# EAGLE design queso_dip_v5 (EAGLE 6.5.0)
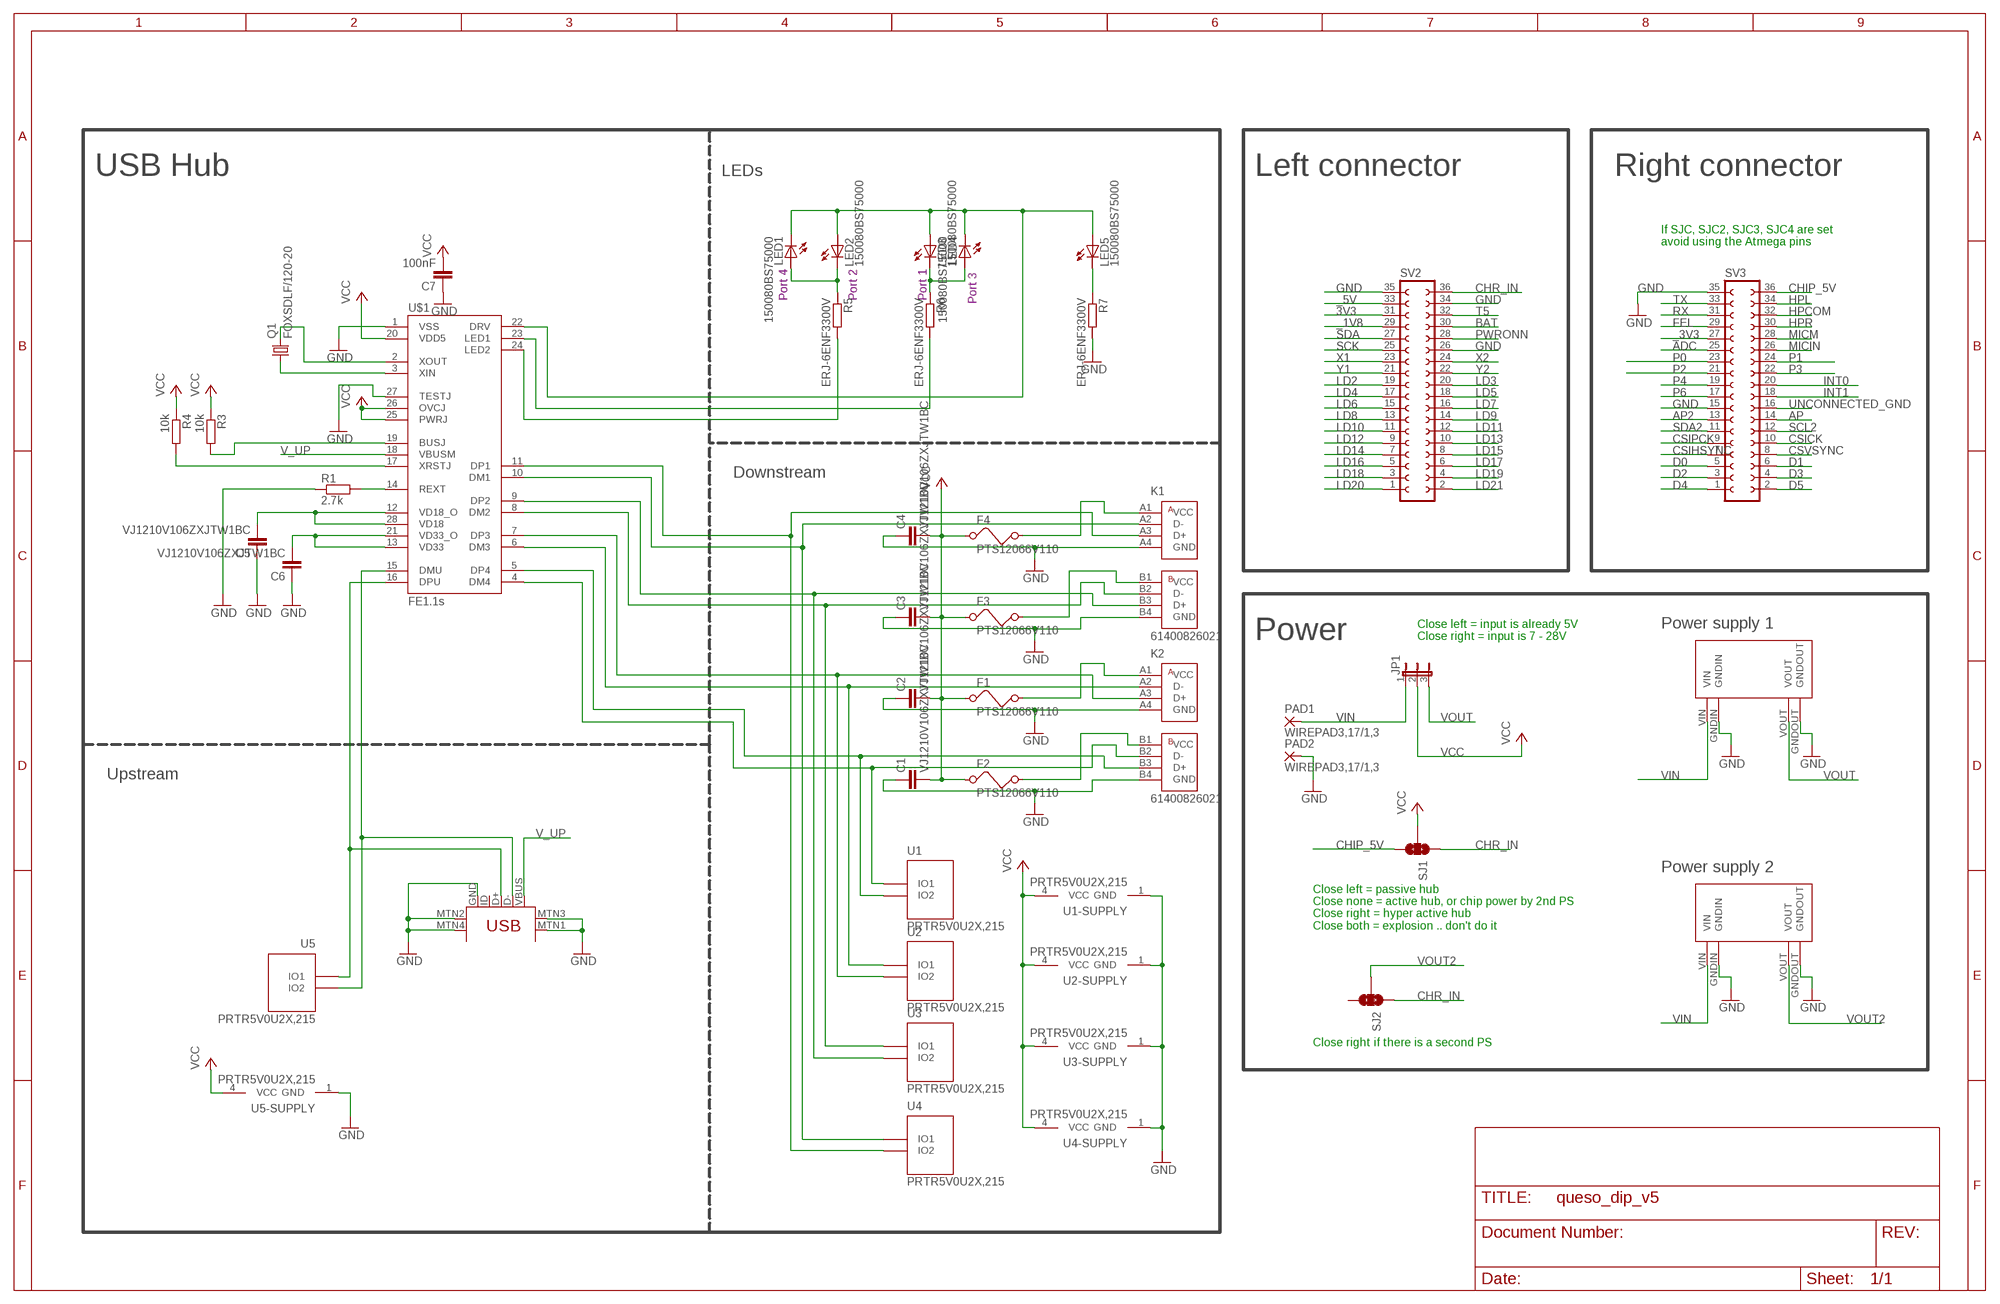
[diagram p0: schematic, sheet 1]

## Parts
C1  VJ1210V106ZXJTW1BC  C-EUC1210  [C1210]
C2  VJ1210V106ZXJTW1BC  C-EUC1210  [C1210]
C3  VJ1210V106ZXJTW1BC  C-EUC1210  [C1210]
C4  VJ1210V106ZXJTW1BC  C-EUC1210  [C1210]
C5  VJ1210V106ZXJTW1BC  C-EUC1210  [C1210]
C6  VJ1210V106ZXJTW1BC  C-EUC1210  [C1210]
C7  100nF  C-EUC0805  [C0805]
F1  PTS12066V110  FUSED  [1210]
F2  PTS12066V110  FUSED  [1210]
F3  PTS12066V110  FUSED  [1210]
F4  PTS12066V110  FUSED  [1210]
JP1  JP2E  [JP2]
K1  61400826021  [61400826021]
K2  61400826021  [61400826021]
LED1  150080BS75000  LEDCHIP-LED0805  [CHIP-LED0805]
LED2  150080BS75000  LEDCHIP-LED0805  [CHIP-LED0805]
LED3  150080BS75000  LEDCHIP-LED0805  [CHIP-LED0805]
LED4  150080BS75000  LEDCHIP-LED0805  [CHIP-LED0805]
LED5  150080BS75000  LEDCHIP-LED0805  [CHIP-LED0805]
PAD1  WIREPAD3,17/1,3  [3,17/1,3]
PAD2  WIREPAD3,17/1,3  [3,17/1,3]
Q1  FOXSDLF/120-20  CRYSTALSM49  [SM49]
R1  2.7k  R-EU_R0805  [R0805]
R3  10k  R-EU_R0805  [R0805]
R4  10k  R-EU_R0805  [R0805]
R5  ERJ-6ENF3300V  R-EU_R0805  [R0805]
R6  ERJ-6ENF3300V  R-EU_R0805  [R0805]
R7  ERJ-6ENF3300V  R-EU_R0805  [R0805]
SJ1  SOLDERJUMPER_2WAYT  [SJ_2]
SJ2  SOLDERJUMPER_2WAYT  [SJ_2]
SV2  FE18-2  [FE18-2]
SV3  FE18-2  [FE18-2]
U1  PRTR5V0U2X,215  PRTR5V0U2X  [SOT-143B]
U2  PRTR5V0U2X,215  PRTR5V0U2X  [SOT-143B]
U3  PRTR5V0U2X,215  PRTR5V0U2X  [SOT-143B]
U4  PRTR5V0U2X,215  PRTR5V0U2X  [SOT-143B]
U5  PRTR5V0U2X,215  PRTR5V0U2X  [SOT-143B]
U$1  FE1.1S  [FE1.1S_SSOP-28]
U$3  MP1584EN  [MP1584EN]
U$8  10118194-0001LF  USB-MINIB-5PIN  [USB-MINIB]
U$9  MP1584EN  [MP1584EN]

## Nets
3V3: SV2.31
_1V8: SV2.29
_3V3: SV3.27
_5V: SV2.33
ADC: SV3.25
AP: SV3.14
AP2: SV3.13
BAT: SV2.30
CHIP_5V: SJ1.3 SV3.36
CHR_IN: SJ1.1 SJ2.1 SV2.36
CSICK: SV3.10
CSIHSYNC: SV3.7
CSIPCK: SV3.9
CSVSYNC: SV3.8
D0: SV3.5
D1: SV3.6
D2: SV3.3
D3: SV3.4
D4: SV3.1
D5: SV3.2
DM1: K1.A2(D-) U4.2(IO1) U$1.10(DM1)
DM2: K1.B2(D-) U3.2(IO1) U$1.8(DM2)
DM3: K2.A2(D-) U2.2(IO1) U$1.6(DM3)
DM4: K2.B2(D-) U1.2(IO1) U$1.4(DM4)
DMU: U5.3(IO2) U$1.15(DMU) U$8.D-
DP1: K1.A3(D+) U4.3(IO2) U$1.11(DP1)
DP2: K1.B3(D+) U3.3(IO2) U$1.9(DP2)
DP3: K2.A3(D+) U2.3(IO2) U$1.7(DP3)
DP4: K2.B3(D+) U1.3(IO2) U$1.5(DP4)
DPU: U5.2(IO1) U$1.16(DPU) U$8.D+
FEL: SV3.29
GND: C1.1 C2.1 C3.1 C4.1 C5.1 C6.1 C7.1 K1.A4(GND) K1.B4(GND) K2.A4(GND) K2.B4(GND) PAD2.1(P) R1.1 R7.2 SV2.26 SV2.34 SV2.35 SV3.15 SV3.35 U1.1(GND) U2.1(GND) U3.1(GND) U4.1(GND) U5.1(GND) U$1.1(VSS) U$1.27(TESTJ) U$3.GNDIN U$3.GNDOUT U$8.GND U$8.MTN1(MTN2) U$8.MTN2(MTN3) U$8.MTN3(MTN1) U$8.MTN4 U$9.GNDIN U$9.GNDOUT
HPCOM: SV3.32
HPL: SV3.34
HPR: SV3.30
INT0: SV3.20
INT1: SV3.18
LD2: SV2.19
LD3: SV2.20
LD4: SV2.17
LD5: SV2.18
LD6: SV2.15
LD7: SV2.16
LD8: SV2.13
LD9: SV2.14
LD10: SV2.11
LD11: SV2.12
LD12: SV2.9
LD13: SV2.10
LD14: SV2.7
LD15: SV2.8
LD16: SV2.5
LD17: SV2.6
LD18: SV2.3
LD19: SV2.4
LD20: SV2.1
LD21: SV2.2
MICIN: SV3.26
MICM: SV3.28
N$1: F2.2 K2.B1(VCC)
N$10: F1.2 K2.A1(VCC)
N$11: F3.2 K1.B1(VCC)
N$12: F4.2 K1.A1(VCC)
N$14: R5.2 U$1.24(LED2)
N$15: R6.2 U$1.23(LED1)
N$17: C6.2 U$1.13(VD33) U$1.21(VD33_O)
N$18: C5.2 U$1.12(VD18_O) U$1.28(VD18)
N$22: R1.2 U$1.14(REXT)
N$24: R4.2 U$1.17(XRSTJ)
N$25: R3.2 U$1.19(BUSJ)
N$27: Q1.2 U$1.2(XOUT)
N$28: Q1.1 U$1.3(XIN)
N$29: LED5.C R7.1
N$30: LED3.C LED4.A R6.1
N$31: LED1.A LED2.C R5.1
N$32: LED1.C LED2.A LED3.A LED4.C LED5.A U$1.22(DRV)
P0: SV3.23
P1: SV3.24
P2: SV3.21
P3: SV3.22
P4: SV3.19
P6: SV3.17
PWRONN: SV2.28
RX: SV3.31
SCK: SV2.25
SCL2: SV3.12
SDA: SV2.27
SDA2: SV3.11
T5: SV2.32
TX: SV3.33
UNCONNECTED_GND: SV3.16
V_UP: U$1.18(VBUSM) U$8.VBUS
VCC: C1.2 C2.2 C3.2 C4.2 C7.2 F1.1 F2.1 F3.1 F4.1 JP1.2 R3.1 R4.1 SJ1.2 U1.4(VCC) U2.4(VCC) U3.4(VCC) U4.4(VCC) U5.4(VCC) U$1.20(VDD5) U$1.25(PWRJ) U$1.26(OVCJ)
VIN: JP1.1 PAD1.1(P) U$3.VIN U$9.VIN
VOUT: JP1.3 U$9.VOUT
VOUT2: SJ2.2 U$3.VOUT
X1: SV2.23
X2: SV2.24
Y1: SV2.21
Y2: SV2.22
Unconnected: SJ2.3 U$8.ID

## Notes on the sheet
- USB Hub | LEDs | Left connector | Right connector
- If SJC, SJC2, SJC3, SJC4 are set 
  avoid using the Atmega pins
- Port 4 | Port 2 | Port 1
- Port 3
- Downstream
- Power supply 1
- Power
- Close left = input is already 5V
  Close right = input is 7 - 28V
- Upstream
- Power supply 2
- Close left = passive hub
  Close none = active hub, or chip power by 2nd PS
  Close right = hyper active hub
  Close both = explosion .. don't do it
- Close right if there is a second PS

## Library data of the parts
C1-C7 = rcl:C-EU: CAPACITOR, European symbol
F1-F4 = m-pad-2.1:FUSE: Fuse's in various packages
JP1 = jumper:JP2E: JUMPER
K1 K2 = Wuerth_Elektronik_eiCan_Communication_Connectors_STENCIL:61400826021: WR-COM Horizontal Dual Stacked USB Type A
LED1-LED5 = led:LED: LED OSRAM: - CHIPLED LG R971, LG N971, LY N971, LG Q971, LY Q971, LO R971, LY R971 LH N974, LH R974 LS Q976, LO Q976, LY Q976 LO Q996 - Hyper CHIPLED LW Q18S LB Q993, LB Q99A, LB R99A - SideLED LS A670, LO A670, LY A670, LG A670, LP A670 LB A673, LV A673, LT A673, LW A673 LH A674 LY A675 LS A676, LA A676, LO A676, LY A676, LW A676 LS A679, LY A679, LG A679 - Hyper Micro SIDELED® LS Y876, LA Y876, LO Y876, LY Y876 LT Y87S - SmartLED LW L88C, LW L88S LB L89C, LB L89S, LG L890 LS L89K, LO L89K, LY L89K LS L896, LA L896, LO L896, LY L896 - TOPLED LS T670, LO T670, LY T670, LG T670, LP T670 LSG T670, LSP T670, LSY T670, LOP T670, LYG T670 LG T671, LOG T671, LSG T671 LB T673, LV T673, LT T673, LW T673 LH T674 LS T676, LA T676, LO T676, LY T676, LB T676, LH T676, LSB T676, LW T676 LB T67C, LV T67C, LT T67C, LS T67K, LO T67K, LY T67K, LW E67C LS E67B, LA E67B, LO E67B, LY E67B, LB E67C, LV E67C, LT E67C LW T67C LS T679, LY T679, LG T679 LS T770, LO T770, LY T770, LG T770, LP T770 LB T773, LV T773, LT T773, LW T773 LH T774 LS E675, LA E675, LY E675, LS T675 LS T776, LA T776, LO T776, LY T776, LB T776 LHGB T686 LT T68C, LB T68C - Hyper Mini TOPLED® LB M676 - Mini TOPLED Santana® LG M470 LS M47K, LO M47K, LY M47K Source: http://www.osram.convergy.de LUXEON: - LUMILED® LXK2-PW12-R00, LXK2-PW12-S00, LXK2-PW14-U00, LXK2-PW14-V00 LXK2-PM12-R00, LXK2-PM12-S00, LXK2-PM14-U00 LXK2-PE12-Q00, LXK2-PE12-R00, LXK2-PE12-S00, LXK2-PE14-T00, LXK2-PE14-U00 LXK2-PB12-K00, LXK2-PB12-L00, LXK2-PB12-M00, LXK2-PB14-N00, LXK2-PB14-P00, LXK2-PB14-Q00 LXK2-PR12-L00, LXK2-PR12-M00, LXK2-PR14-Q00, LXK2-PR14-R00 LXK2-PD12-Q00, LXK2-PD12-R00, LXK2-PD12-S00 LXK2-PH12-R00, LXK2-PH12-S00 LXK2-PL12-P00, LXK2-PL12-Q00, LXK2-PL12-R00 Source: www.luxeon.com KINGBRIGHT: KA-3528ASYC Source: www.kingbright.com
PAD1 PAD2 = wirepad:WIREPAD: Wire PAD connect wire on PCB
Q1 = adafruit:CRYSTAL: CRYSTAL; OC_FARNELL: unknown; OC_NEWARK: unknown
R1 R3-R7 = rcl:R-EU_: RESISTOR, European symbol
SJ1 SJ2 = SparkFun-Retired:SOLDERJUMPER_2WAY: Solder Jumper 2 way solder jumper
SV2 SV3 = con-lsta:FE18-2: FEMALE HEADER; OC_FARNELL: unknown; OC_NEWARK: unknown
U1-U5 = Volks73-NXPSemiconductors:PRTR5V0U2X?: I2C-Bus EDS Protection Ulta low capacitance double rail-to-rail ESD protection diode Documentation Datasheet <http://www.nxp.com/documents/data_sheet/PRTR5V0U2X.pdf> General Description Ultra low capacitance rail-to-rail ElectroStatic Discharge (ESD) protection diode in a small SOT143B Surface-Mounted Device (SMD) plastic package designed to protect two Hi-Speed data lines or high-frequency signal lines from the damage caused by ESD and other transients. PRTR5V0U2X incorporates two pairs of ultra low capacitance rail-to-rail diodes as well as an additional ESD protection diode to ensure signal line protection even if no supply voltage is available. Features ESD protection of two Hi-Speed data lines or high-frequency signal lines Ultra low input/output to ground capacitance: C(I/O-GND) = 1 pF ESD protection up to 8kV IEC 61000-4-2, level 4 (ESD) Very low clamping voltage due to an integrated additional ESD protection diode Very low reverse current Small SMD plastic package Applications USB 2.0 ports Digital Video Interface (DVI)/High Definition Multimedia Interface (HDMI) interfaces Mobile and cordless phones Personal Digital Assistants (PDA) Digital Cameras Wide Area Network (WAN) / Local Area Network (LAN) systems PCs, notebooks, printers, and other PC peripherals; APPLICATIONS: General Purpose; BIDIRECTIONAL_CHANNELS: 2; CAPACITANCE: 1pF @ 1MHz; CURRENT_PEAK_PULSE: -; DESCRIPTION: TVS DIODE 5.5VWM SOT143B; DOCUMENTATION_LINK: <a href="http://www.nxp.com/documents/data_sheet/PRTR5V0U2X.pdf">Datasheet</a>; DOCUMENTATION_URL: http://www.nxp.com/documents/data_sheet/PRTR5V0U2X.pdf; MANUFACTURER: NXP Semiconductors; MOUNTING_TYPE: Surface Mount; OPERATING_TEMPERATURE: -40C ~ 85C; PART_NUMBER: PRTR5V0U2X,215; POWER-PEAK_PULSE: -; POWER_LINE_PROTECTION: Yes; SUPPLIER_ITEM_LINK: <a href="http://www.digikey.com/product-detail/en/PRTR5V0U2X,215/568-4140-1-ND/1589981">Details</a>; SUPPLIER_ITEM_NUMBER: 568-4140-1-ND; SUPPLIER_ITEM_URL: http://www.digikey.com/product-detail/en/PRTR5V0U2X,215/568-4140-1-ND/1589981; SUPPLIER_LINK: <a href="http://www.digikey.com">Home Page</a>; SUPPLIER_NAME: Digi-Key; SUPPLIER_URL: http://www.digikey.com; TYPE: Steering (Rail to Rail); UNIDIRECTIONAL_CHANNELS: -; VOLTAGE_BREAKDOWN: 6V; VOLTAGE_CLAMPING: -; VOLTAGE_REVERSE: 5.5V
U$1 = imcom:FE1.1S: A USB 2.0 hub IC. http://www.jfd-ic.com/Documents/FE1.1s%20Data%20Sheet%20%28Rev.%201.0%29.pdf
U$3 U$9 = power_supply:MP1584EN
U$8 = SparkFun-Connectors:USB-MINIB: Mini-USB "B" connector with 5th pin broken out. Created new symbol breaking out 5th "ID" pin in mini/micro USB connector spec. See: http://en.wikipedia.org/wiki/Mini_usb#Cables. Uses same footprint as 4-pin symbol. Also added pins to connect to mounting / shield pads if required (probably not generally needed as signals aren't shielded once they leave the connector).

## Board
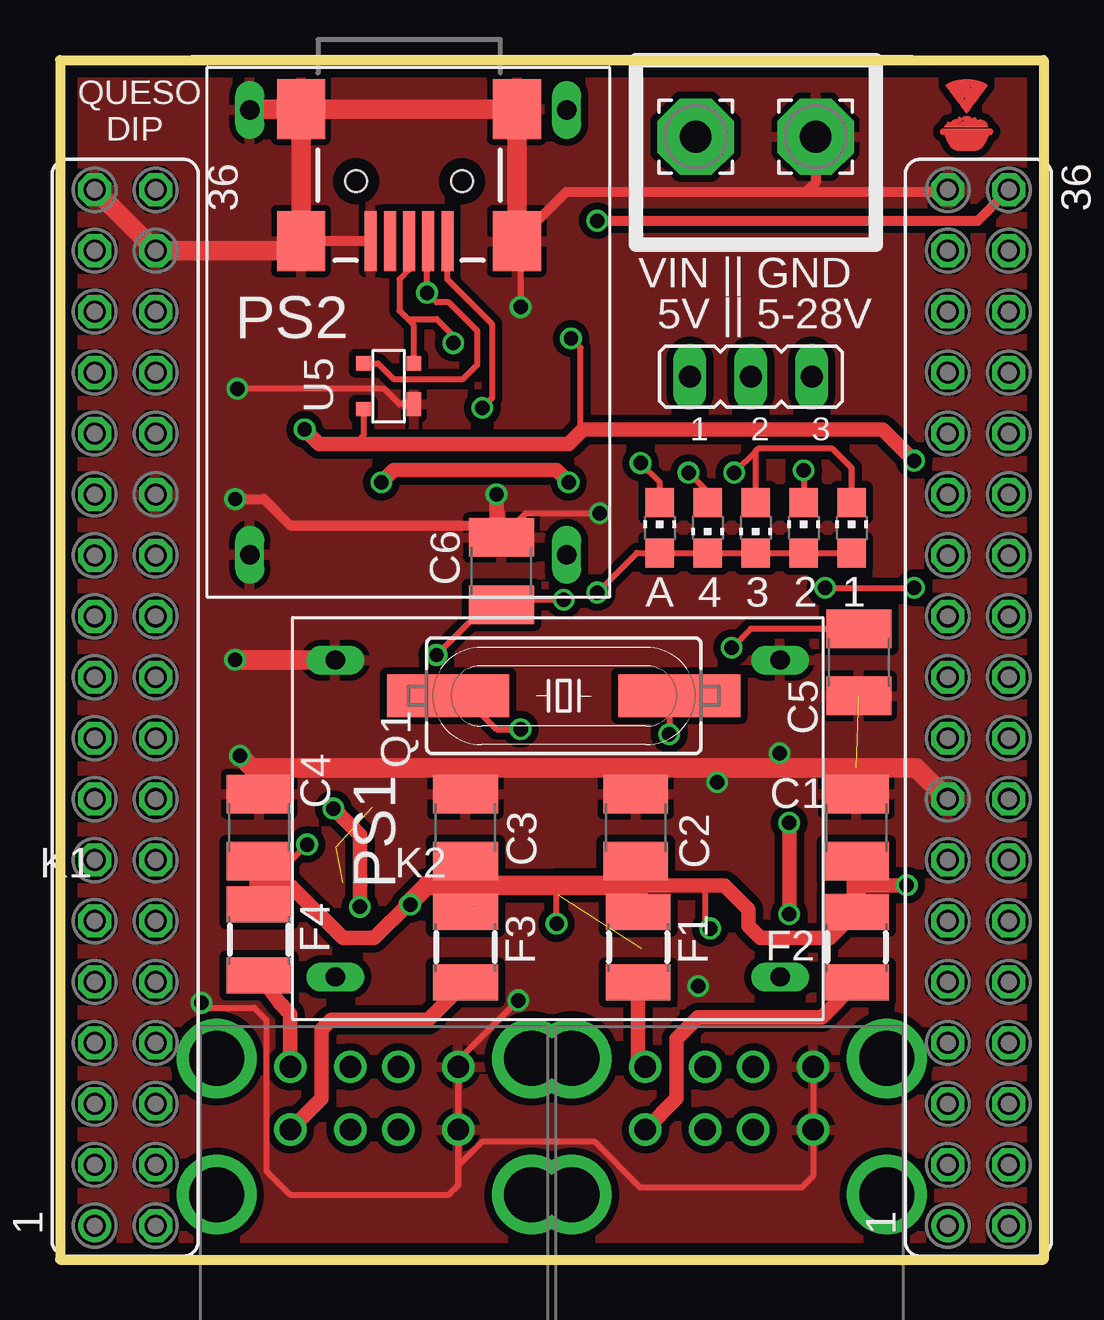
[diagram p1: board, top side]
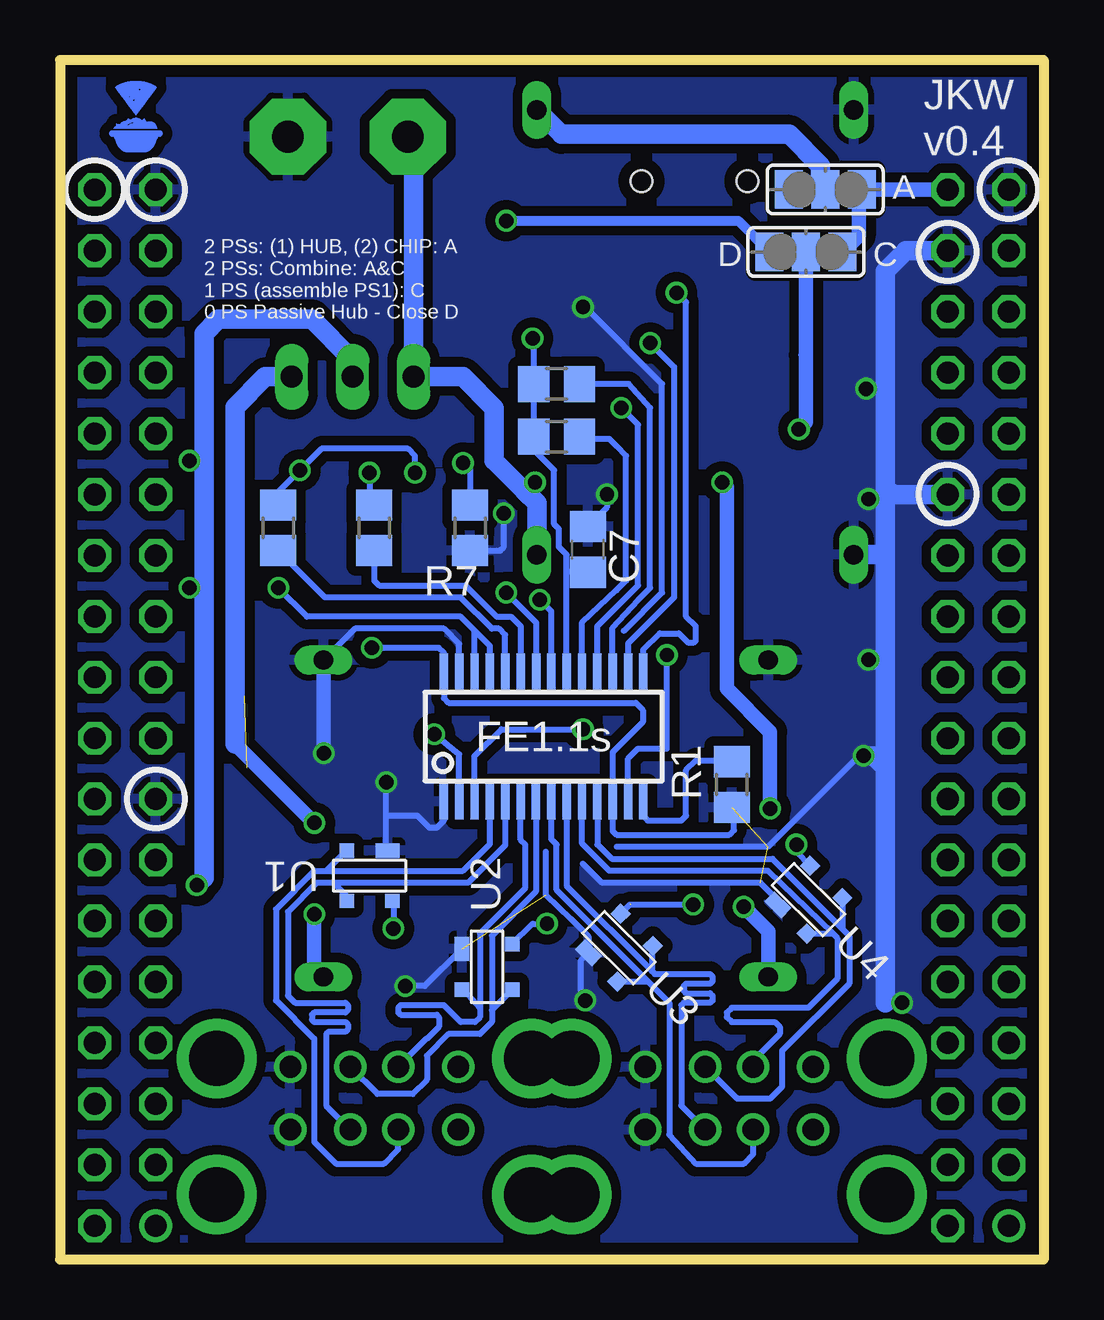
[diagram p2: board, bottom side, seen from below]

Size 41 x 50 mm. Coordinates in mm from the lower left corner, seen from the top.
Outline: 0,50 41,50 41,0 0,0 0,50
Copper layers (1*16): Top 0.035mm / dielectric 1.6mm / Bottom 0.035mm
Design rules "Elecrow_2-layer_PCB_eagle_rule": minimum track width 6mil, minimum drill 12mil, track to track 6mil, track to pad 6mil, pad to pad 6mil, via to via 8mil, smd to smd 0mil, copper to edge 20mil, drill to drill 10mil, minimum pad ring 6mil, minimum via ring 6mil, stop-mask expansion 0mil, vias tented up to drill 100mil, thermal gap 10mil

### Footprints (pad centres in the part's own frame; a part is rotated, then mirrored left to right if it is on the bottom)
C1210 = smd 1.6 x 2.7: 1 -1.4,0; 2 1.4,0
C0805 = smd 1.3 x 1.5: 1 -0.95,0; 2 0.95,0
1210 = smd 1.5 x 2.7: 1 -1.5,0; 2 1.45,0
JP2 = drill 0.914 long: 1 -2.54,0; 2 0,0; 3 2.54,0
61400826021 = drill 2.3: 5 -6.57,5.68; 6 -6.57,0; 7 6.57,0; 8 6.57,5.68 | drill 0.9: A1 -3.5,5.33; A2 -1,5.33; A3 1,5.33; A4 3.5,5.33; B1 -3.5,2.71; B2 -1,2.71; B3 1,2.71; B4 3.5,2.71
CHIP-LED0805 = smd 1.2 x 1.2: A 0,-1.05; C 0,1.05
3,17/1,3 = drill 1.321 pad 3.175 octagon: 1 0,0
SM49 = smd 5.08 x 1.778: 1 -4.826,0; 2 4.826,0
R0805 = smd 1.3 x 1.5: 1 -0.95,0; 2 0.95,0
SJ_2 = smd 1.168 x 1.6: 1 -1.524,0; 2 0,0; 3 1.524,0
FE18-2 = drill 0.914: 1 -21.59,1.27 | drill 0.914 octagon: 2 -21.59,-1.27; 3 -19.05,1.27; 4 -19.05,-1.27; 5 -16.51,1.27; 6 -16.51,-1.27; 7 -13.97,1.27; 8 -13.97,-1.27; 9 -11.43,1.27; 10 -11.43,-1.27; 11 -8.89,1.27; 12 -8.89,-1.27; 13 -6.35,1.27; 14 -6.35,-1.27; 15 -3.81,1.27; 16 -3.81,-1.27; 17 -1.27,1.27; 18 -1.27,-1.27; 19 1.27,1.27; 20 1.27,-1.27; 21 3.81,1.27; 22 3.81,-1.27; 23 6.35,1.27; 24 6.35,-1.27; 25 8.89,1.27; 26 8.89,-1.27; 27 11.43,1.27; 28 11.43,-1.27; 29 13.97,1.27; 30 13.97,-1.27; 31 16.51,1.27; 32 16.51,-1.27; 33 19.05,1.27; 34 19.05,-1.27; 35 21.59,1.27; 36 21.59,-1.27
SOT-143B = smd 1 x 0.6: 1 -0.75,-1.05 | smd 0.6 x 0.6: 2 0.95,-1.05; 3 0.95,1.05; 4 -0.95,1.05
FE1.1S_SSOP-28 = smd 0.35 x 1.5: 1 -4.16,-2.7; 2 -3.52,-2.7; 3 -2.88,-2.7; 4 -2.24,-2.7; 5 -1.6,-2.7; 6 -0.96,-2.7; 7 -0.32,-2.7; 8 0.32,-2.7; 9 0.96,-2.7; 10 1.6,-2.7; 11 2.24,-2.7; 12 2.88,-2.7; 13 3.52,-2.7; 14 4.16,-2.7; 15 4.16,2.7; 16 3.52,2.7; 17 2.88,2.7; 18 2.24,2.7; 19 1.6,2.7; 20 0.96,2.7; 21 0.32,2.7; 22 -0.3,2.7; 23 -0.96,2.7; 24 -1.6,2.7; 25 -2.24,2.7; 26 -2.88,2.7; 27 -3.52,2.7; 28 -4.16,2.7
MP1584EN = drill 0.8 long: GNDIN 1.778,14.986; GNDOUT 20.32,14.986; VIN 1.778,1.778; VOUT 20.32,1.778
USB-MINIB = smd 2.5 x 0.5: D+ 2.5,0; D- 2.5,0.8; GND 2.5,-1.6; ID 2.5,-0.8; VBUS 2.5,1.6 | smd 2.5 x 2: MTN1 -3,4.5; MTN2 2.5,4.5; MTN3 -3,-4.5; MTN4 2.5,-4.5 | hole 0.9: 0,2.2; 0,-2.2

### Placement (x,y rotation side)
C1  33.2,18 270 top
C2  24,18 270 top
C3  16.9,18 270 top
C4  8.3,18 270 top
C5  33.3,24.9 90 top
C6  18.4,28.7 270 top
C7  19,29.6 270 bottom
F1  24.1,13 270 top
F2  33.2,13 270 top
F3  16.9,13 270 top
F4  8.3,13.3 270 top
JP1  28.8,36.8 0 top
K1  13.1,2.7 0 top
K2  27.9,2.7 0 top
LED1  27,30.5 180 top
LED2  31,30.5 0 top
LED3  33,30.5 0 top
LED4  29,30.5 180 top
LED5  25,30.5 0 top
PAD1  26.5,46.8 0 top
PAD2  31.5,46.8 0 top
Q1  21,23.5 0 top
R1  13,19.8 90 bottom
R3  20.3,34.3 0 bottom
R4  20.3,36.5 0 bottom
R5  31.9,30.5 270 bottom
R6  27.9,30.5 270 bottom
R7  23.9,30.5 270 bottom
SJ1  9.9,42 180 bottom
SJ2  9.1,44.6 180 bottom
SV2  2.72,23 90 top
SV3  38.28,23 90 top
U1  28.1,16 180 bottom
U2  23.2,12.2 270 bottom
U3  17.7,13 315 bottom
U4  9.8,15 315 bottom
U5  13.7,36.4 90 top
U$1  20.84,21.8 0 bottom
U$2  LOGO  [LOGO]  36.54,46.02 0 top
U$3  22.9,27.6 90 top
U$5  LOGO  [LOGO]  39.09,46.1 0 bottom
U$8  14.55,44.95 270 top
U$9  9.7,10 0 top

### Tracks (layer width: path | path; a pad name or v marks a point on that pad's centre or on a via)
CHIP_5V  (via drill 0.6)
  Top 0.406: v22.4,43.3 38.26,43.3 SV3.36
  Bottom 0.406: v22.4,43.3 12.72,43.3 SJ1.3
CHR_IN
  Bottom 0.61: SV2.36 7.77,44.59 SJ2.1 7.7,44.52 7.7,42.68 SJ1.1 | SJ1.1 8.39,42.31
  Bottom 0.813: SJ1.1
DM1
  Bottom 0.254: 8.79,13.59 11.5,16.2 18.1,16.2 19.24,17.34 U$1.10 | U4.2 8.79,13.59 | 8.79,13.59 8.6,13.4 8.6,11.7 9.8,10.5 13,10.5 13.2,10.3 13.2,10.1 13,9.9 11.2,9.9 11,9.7 11,9.4 12.1,8.3 K1.A2
DM2
  Bottom 0.254: 16.49,11.59 20.3,15.4 20.3,17.3 20.52,17.52 U$1.8 | U3.2 16.49,11.59 | 16.49,11.59 15.6,10.7 15.6,5.2 14.5,4 12.5,4 12.1,4.4 K1.B2
DM3
  Bottom 0.254: U$1.6 21.8,17.5 21.6,17.3 21.6,15.5 23.5,13.6 23.5,10.5 | 23.5,10.5 23.5,10.1 23.7,9.9 24.3,9.9 25,10.6 26.8,10.6 26.9,10.5 26.9,10.3 26.8,10.2 25.3,10.2 25.2,10.1 25.2,9.7 25.7,9.2 25.73,9.2 K2.A2 | U2.2 24.15,11.25 23.5,10.5
DM4
  Bottom 0.254: 29.9,16.2 30.4,16.2 32,14.6 32,10.8 30.4,9.2 30.4,4.9 29.5,4 27.5,4 26.9,4.6 K2.B2 | 29.9,16.2 24.2,16.2 23.08,17.32 U$1.4 | U1.2 29.9,16.2
DMU  (via drill 0.6)
  Top 0.254: U$8.D- 15.3,42.4 v15.3,40.3 15.7,39.9 16.2,39.9 17.4,38.7 17.4,37.3 16.8,36.7 13.9,36.7 13.25,37.35 U5.3
  Bottom 0.254: U$1.15 16.68,25.42 16,26.1 15.2,26.1 14.8,25.7 14.6,25.7 14.5,25.8 14.5,26.4 14.9,26.8 14.9,39.9 v15.3,40.3
DP1
  Bottom 0.254: U$1.11 18.6,17.3 18,16.7 11.3,16.7 8.39,13.79 | 8.39,13.79 8.1,13.5 8.1,11.5 10.9,8.7 10.9,7.2 11.4,6.7 12.77,6.7 K1.A3 | U4.3 8.39,13.79
DP2
  Bottom 0.254: U$1.9 19.88,15.58 16.33,12.03 | U3.3 16.33,13.07 16.33,12.03 | K1.B3 15.1,6.41 15.1,10.6 15,10.7 13.9,10.7 13.8,10.8 13.8,11 13.9,11.1 14.9,11.1 15,11.2 15,11.4 14.9,11.5 13.9,11.5 13.8,11.6 13.8,11.8 13.9,11.9 16.2,11.9 16.33,12.03
DP3
  Bottom 0.254: U$1.7 21.16,15.34 23,13.5 23,10.4 | U2.3 23,10.4 | 23,10.4 23,9.9 23.5,9.4 24.8,9.4 25.7,8.5 25.7,7.5 26.3,6.9 27.77,6.9 K2.A3
DP4
  Bottom 0.254: U$1.5 22.44,17.26 24,15.7 29.6,15.7 | 29.6,15.7 30.3,15.7 31.5,14.5 31.5,11 31.2,10.7 29.1,10.7 29,10.6 29,10.4 29.1,10.3 30.4,10.3 30.5,10.2 30.5,10 30.4,9.9 29.1,9.9 29,9.8 29,9.6 29.1,9.5 29.8,9.5 29.9,9.4 29.9,6.41 K2.B3 | U1.3 29.05,15.15 29.6,15.7
DPU  (via drill 0.6)
  Top 0.254: U$8.D+ 14.55,41.25 14.15,40.85 14.15,39.55 14.5,39.2 | 14.5,39.2 15.7,39.2 16.4,38.5 v16.4,38.2 | U5.2 14.75,38.95 14.5,39.2
  Bottom 0.254: U$1.16 17.32,25.68 15.95,27.05 15.8,27.2 15.4,27.6 15.4,37.2 v16.4,38.2
GND  (via drill 0.6)  (4 unrouted)
  Top 0.254: v27.4,19.9 27.4,20.5 | 18.4,31.2 C6.1 19.4,31.1 v22.5,31.1 | U5.1 14.15,35.65 13.5,36.3 v7.4,36.3 | U$8.MTN2 19.2,42.3 v19.2,39.7 | v5.9,10.7 6.1,10.5 8.1,10.5 8.6,10 8.6,3.7 9.6,2.7 16.2,2.7 16.6,3.1 16.6,3.9 | 16.6,3.9 K1.B4 K1.A4 16.6,8.3 v19.1,10.8 | K2.B4 K2.A4 31.4,3.5 30.9,3 24.2,3 22.3,4.9 17.6,4.9 16.6,3.9
  Top 0.406: U$8.GND U$8.MTN4 | PAD2.1 31.5,44.9 31.1,44.5 | 31.1,44.5 21.1,44.5 U$8.MTN2 | SV3.35 36.92,44.5 31.1,44.5 | v7.3,31.7 8.5,31.7 9.6,30.6 17.9,30.6 C6.1
  Top 0.61: v30,21.1 30,20.5 | v18.2,31.9 18.2,30.8 C6.1
  Top 0.813: U$8.MTN3 U$8.MTN1 U$8.MTN2 | SV2.35 SV2.34 9.65,42.05 U$8.MTN4 U$8.MTN3 | U$3.GNDOUT 7.94,47.95 U$8.MTN3 | U$9.GNDIN 7.31,24.99 v7.3,25 | C4.1 8.3,20.3 | 8.3,20.3 8.3,20.5 8,20.5 v7.5,21 | C3.1 16.9,20.5 | 16.9,20.5 24,20.5 | 24,20.5 27.4,20.5 30,20.5 33.2,20.5 | 16.9,20.5 8.5,20.5 8.3,20.3 | C1.1 33.2,20.5 | C2.1 24,20.5 | SV3.15 35.7,20.5 33.2,20.5
  Bottom 0.254: U1.1 27.4,17.1 27.4,18.5 | 27.4,18.5 v27.4,19.9 | U$1.1 25,18.3 25.3,18 25.6,18 26.1,18.5 27.4,18.5 | U2.1 25.8,11.4 v26.6,11.4 | U$1.27 24.36,25.66 25,26.3 28.71,26.3 U$9.GNDOUT | R7.2 22.65,29.55 22.5,29.7 v22.5,31.1 | v7.4,36.3 6.6,36.3 | v18.2,31.9 18.2,31.35 C7.1 | 17.8,17.2 11.5,17.2 7.7,21 v7.5,21 | 19.2,16.5 18.4,15.7 11.8,15.7 11.07,14.97 U4.1 | 20.75,17 20.75,15.2 19.7,14.2 18.97,13.47 U3.1 19.3,12.46 19.3,11 v19.1,10.8 | 17.5,26.2 15.9,27.8 15.9,36.5 19.1,39.7 v19.2,39.7
  Bottom 0.406: 6.6,31.7 v7.3,31.7 | 6.6,10.7 v5.9,10.7
  Bottom 0.61: U$9.GNDOUT 30.02,21.12 v30,21.1
  Bottom 0.813: SV2.34 5.75,42.05 6.6,41.2 6.6,36.3 6.6,32.2 | 6.6,32.2 6.6,31.7 6.6,29.3 | 6.6,29.3 6.6,25 | 6.6,25 6.6,20.5 | 6.6,20.5 6.6,10.7 | v7.3,25 6.6,25 | U$3.GNDIN 6.68,29.38 6.6,29.3 | SV2.26 6.29,31.89 6.6,32.2 | 6.6,20.5 7.1,21 v7.5,21
  pour Top (isolate 0.305, rank 2): -0.07,0.25 40.88,0.25 41.01,10.57 41.01,50.01 0,50.01 0,10.47
  pour Bottom (isolate 0.406): 0,50 41.05,50 41.05,0.25 0.02,0.25 0.02,49.92
N$1
  Top 0.61: K2.B1 25.7,6.71 25.7,9.2 26.6,10.1 31.75,10.1 F2.2
N$10
  Top 0.61: 24.15,11.5 F1.2 24.1,8.33 K2.A1
N$11
  Top 0.61: 16.65,11.3 F3.2 15.35,10 11.3,10 10.9,9.6 10.9,6.71 K1.B1
N$12
  Top 0.61: F4.2 9.15,10.7 9.6,10.25 K1.A1
N$14
  Bottom 0.254: U$1.24 22.44,26.04 22.7,26.3 23,26.3 24.3,27.6 29.95,27.6 R5.2
N$15
  Bottom 0.254: R6.2 27.9,28.3 27.7,28.1 24.1,28.1 22.8,26.8 22.2,26.8 21.8,26.4 U$1.23
N$17  (via drill 0.6)
  Top 0.254: 18.6,27.6 C6.2 | v21,27.5 18.7,27.5 C6.2 | v15.7,25.2 18.3,27.8 C6.2
  Bottom 0.254: U$1.13 17.32,20.88 16.9,21.3 15.7,21.3 v15.7,25.2 | U$1.21 20.52,27.02 v21,27.5
N$18  (via drill 0.6)
  Top 0.254: v28,25.5 28.8,26.3 C5.2
  Bottom 0.254: 12.9,18.75 12.9,17.9 13.1,17.7 17.8,17.7 17.96,17.86 U$1.12 17.96,21.14 16.7,22.4 16.7,22.9 17,23.2 24.8,23.2 25,23.4 U$1.28 25,25.3 25.2,25.5 v28,25.5
N$22
  Bottom 0.254: U$1.14 16.68,18.48 16.5,18.3 15.1,18.3 14.9,18.5 14.9,20.4 14.5,20.8 13.05,20.8 R1.2
N$24
  Bottom 0.254: U$1.17 17.96,26.34 16.9,27.5 16.4,28 16.4,35.5 17.3,36.5 R4.2
N$25
  Bottom 0.254: U$1.19 19.24,26.56 17.8,27.9 17.4,28.3 17.4,33.5 17.8,33.9 18.1,34.2 19.25,34.2 R3.2
N$27  (via drill 0.6)
  Top 0.254: Q1.2 25.1,23.7 25.4,23.4 v25.4,21.9
  Bottom 0.254: U$1.2 24.36,21.06 v25.4,21.9
N$28  (via drill 0.6)
  Top 0.254: Q1.1 16.6,23.7 18.2,22.1 v19.2,22.1
  Bottom 0.254: U$1.3 23.72,20.98 22.6,22.1 v19.2,22.1
N$29  (via drill 0.6)
  Top 0.254: LED5.C 25,32.4 v24.2,33.2
  Bottom 0.254: v24.2,33.2 23.9,32.9 R7.1
N$30  (via drill 0.6)
  Top 0.254: LED3.C 33,33 32.2,33.8 29.1,33.8 29,33.7 | 29,33.7 v28.1,32.8 | LED4.A 29,33.7
  Bottom 0.254: v28.1,32.8 28.1,31.65 R6.1
N$31  (via drill 0.6)
  Top 0.254: v31,32.9 LED2.C | LED1.A 27,32 v26.2,32.8
  Bottom 0.254: R5.1 31.9,32 v31,32.9 30.1,33.8 26.5,33.8 26.2,33.5 v26.2,32.8
N$32  (via drill 0.6)
  Top 0.254: v22.4,27.8 24.05,29.45 LED5.A LED1.C 28.9,29.45 LED4.C LED2.A LED3.A
  Bottom 0.254: U$1.22 21.14,26.54 v22.4,27.8
V_UP  (via drill 0.6)
  Top 0.254: U$8.VBUS 16.15,40.85 18,39 18,35.9 v17.6,35.5 17.8,35.7
  Bottom 0.254: U$1.18 18.6,26.4 16.9,28.1 16.9,34.8 v17.6,35.5 17.3,35.2
VCC  (via drill 0.6)  (1 unrouted)
  Top 0.254: v10.3,17.3 9.6,16.6 C4.2 | v14.6,14.8 14.5,14.9 | v20.7,14 20.7,15.6 | v27.1,13.8 26.9,14 26.9,15.6 | F1.1 24,14.6 24,15.6 | U5.4 12.65,34.35 12.3,34 | v31.9,28 v35.6,28 | 21.2,34 21.2,34.1 21.7,34.6 21.7,38 v21.3,38.4 | 17.2,15 17.1,15.1 17.1,15.6
  Top 0.61: 8.5,15.6 9.6,15.6 11.8,13.4 13.1,13.4 14.5,14.8 | v35.6,33.3 34.3,34.6 21.8,34.6 21.2,34 12.3,34 10.8,34 v10.2,34.6 | 24,15.6 26.9,15.6 27.7,15.6 28.7,14.6 28.7,13.9 29.2,13.4 32.1,13.4 F2.1 | v35.3,15.6 33.3,15.6 33.2,15.5
  Top 0.813: F4.1 8.3,15.4 | 8.3,15.4 C4.2 | C3.2 F3.1 17.2,14.8 17.2,15 | F1.1 24.1,16.5 C2.2 | F2.1 33.2,15.5 C1.2 | 24,15.6 20.7,15.6 17.1,15.6 15.3,15.6 14.5,14.8 | 8.5,15.6 8.3,15.4
  Bottom 0.254: U$1.25 23.08,25.58 23.72,26.22 | 23.72,26.22 24.3,26.8 30.7,26.8 v31.9,28 | U$1.26 23.72,26.22 | U4.4 10.3,16.98 v10.3,17.3 | U3.4 17.24,14.8 v14.6,14.8 | U2.4 21.3,14 v20.7,14 | U1.4 27.1,14.9 v27.1,13.8 | 10.1,37.7 9.9,37.5 | 35,27 34.8,26.8 | v35.6,28 35,28 | U$1.20 19.88,28.7 | 19.88,28.7 19.88,29.38 20.2,29.7 20.2,30.45 20.4,30.65 20.4,32.9 21.25,33.75 R3.1 R4.1 21.25,38.35 v21.3,38.4 | C7.2 19.83,28.65 19.88,28.7
  Bottom 0.61: SJ1.2 9.9,37.5 9.9,34.9 v10.2,34.6 | v35.6,33.3 35,33.3
  Bottom 0.813: v35.3,15.6 35,15.9 35,27 35,28 35,33.3 35,38.6 34.4,39.2 30.5,39.2 28.8,37.5 JP1.2
VIN  (via drill 0.6)
  Top 0.61: v12.5,14.7 12.5,17.7 v11.4,18.8 | v13.4,32.4 13.9,32.9 20.7,32.9 v21.2,32.4
  Bottom 0.61: U$9.VIN 11.48,13.68 v12.5,14.7 | v11.4,18.8 11.4,22 13.2,23.8 13.2,32.2 v13.4,32.4 | v21.2,32.4 21.3,32.4 21.65,32.05
  Bottom 0.813: U$3.VIN 21.12,31.52 21.65,32.05 22.9,33.3 22.9,35.5 24.2,36.8 JP1.1 26.26,46.56 PAD1.1
VOUT  (via drill 0.6)
  Top 0.61: v30.4,14.4 v30.4,18.2
  Bottom 0.61: U$9.VOUT 30.4,12.16 v30.4,14.4 | v30.4,18.2 33.7,21.5
  Bottom 0.813: 33.7,21.5 33.7,35.54 32.44,36.8 JP1.3
VOUT2
  Bottom 0.813: U$3.VOUT 20.1,46.9 10.6,46.9 9.3,45.6 9.3,44.8 SJ2.2

### Text on the board
tPlace: 5V || 5-28V | dual double jacks / not ordered
bPlace: JKW / v0.4
tNames: QUESO / DIP | VIN || GND | PS2 | A 4 3 2 1 | PS1
bNames: A | C | D | 2 PSs: (1) HUB, (2) CHIP: A / 2 PSs: Combine: A&C / 1 PS (assemble PS1): C / 0 PS Passive Hub - Close D